# Altium project SCH-45852_C.PrjPcb (part 2 of 3)

## Sheet 07 SAI.SchDoc
size 513 x 386 mm
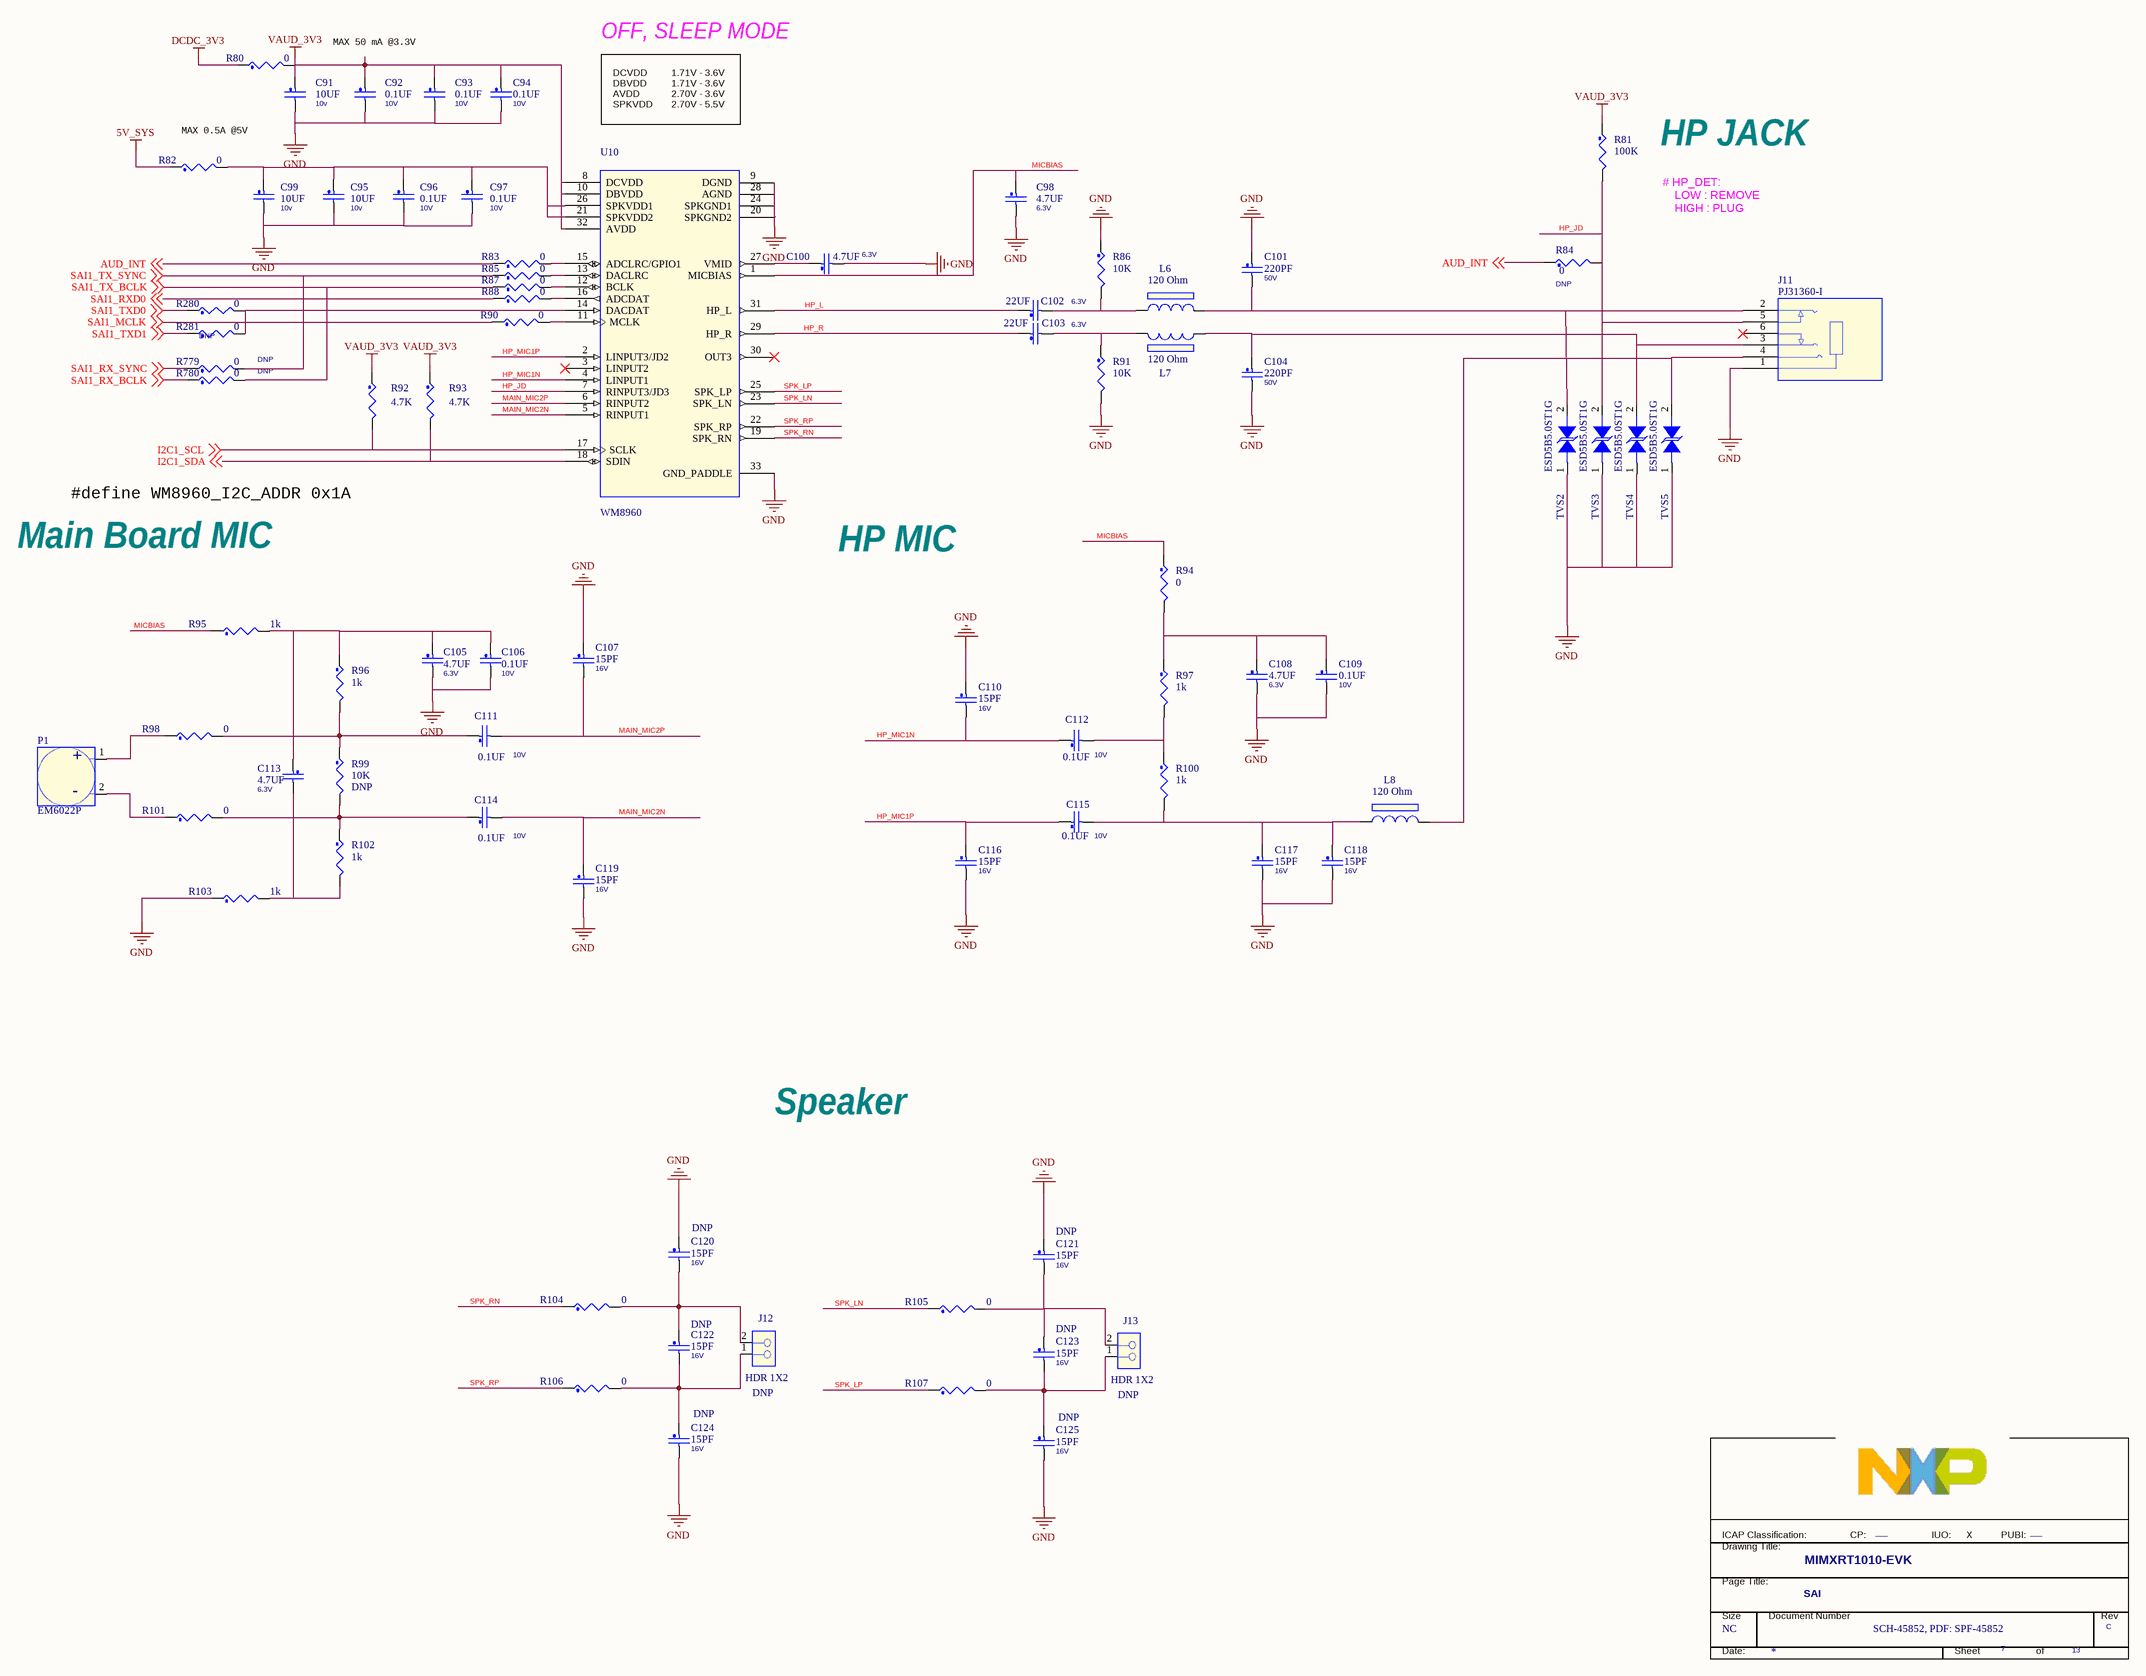
[diagram p7: 07 SAI.SchDoc]

### Parts
(Parts that share a designator on the sheet are numbered #1, #2 ... from top to bottom, then left to right.)
*#7  PUBI: ___  Doc: SCH-45852, PDF: SPF-45852  RevCode: C  Title: MIMXRT1010-EVK  Page Size: NC  Page Number: 7  Page Count: 13  PageTitle: SAI  (hidden comment: TitleBlock_FS)  (graphical)
C91  10UF  VOLTAGE: 10v  [CC0603_OV]
C92  0.1UF  VOLTAGE: 10V  [CC0402_25]
C93  0.1UF  VOLTAGE: 10V  [CC0402_25]
C94  0.1UF  VOLTAGE: 10V  [CC0402_25]
C95  10UF  VOLTAGE: 10v  [CC0603_OV]
C96  0.1UF  VOLTAGE: 10V  [CC0402_25]
C97  0.1UF  VOLTAGE: 10V  [CC0402_25]
C98  4.7UF  VOLTAGE: 6.3V  [0402_CC]
C99  10UF  VOLTAGE: 10v  [CC0603_OV]
C100  4.7UF  VOLTAGE: 6.3V  [0402_CC]
C101  220PF  VOLTAGE: 50V  [0402_CC]
C102  22UF  VOLTAGE: 6.3V  [CC0603_OV]
C103  22UF  VOLTAGE: 6.3V  [CC0603_OV]
C104  220PF  VOLTAGE: 50V  [0402_CC]
C105  4.7UF  VOLTAGE: 6.3V  [0402_CC]
C106  0.1UF  VOLTAGE: 10V  [CC0402_25]
C107  15PF  VOLTAGE: 16V  [0402_CC]
C108  4.7UF  VOLTAGE: 6.3V  [0402_CC]
C109  0.1UF  VOLTAGE: 10V  [CC0402_25]
C110  15PF  VOLTAGE: 16V  [0402_CC]
C111  0.1UF  VOLTAGE: 10V  [CC0402_25]
C112  0.1UF  VOLTAGE: 10V  [CC0402_25]
C113  4.7UF  VOLTAGE: 6.3V  [0402_CC]
C114  0.1UF  VOLTAGE: 10V  [CC0402_25]
C115  0.1UF  VOLTAGE: 10V  [CC0402_25]
C116  15PF  VOLTAGE: 16V  [0402_CC]
C117  15PF  VOLTAGE: 16V  [0402_CC]
C118  15PF  VOLTAGE: 16V  [0402_CC]
C119  15PF  VOLTAGE: 16V  [0402_CC]
C120  15PF  ASSY_OPT: DNP  VOLTAGE: 16V  [0402_CC]
C121  15PF  ASSY_OPT: DNP  VOLTAGE: 16V  [0402_CC]
C122  15PF  ASSY_OPT: DNP  VOLTAGE: 16V  [0402_CC]
C123  15PF  ASSY_OPT: DNP  VOLTAGE: 16V  [0402_CC]
C124  15PF  ASSY_OPT: DNP  VOLTAGE: 16V  [0402_CC]
C125  15PF  ASSY_OPT: DNP  VOLTAGE: 16V  [0402_CC]
J11  PJ31360-I  [con6_audjack_ra_th]
J12  HDR 1X2  ASSY_OPT: DNP  [HDR102]
J13  HDR 1X2  ASSY_OPT: DNP  [HDR102]
L6  120 Ohm  [0402_CC]
L7  120 Ohm  [0402_CC]
L8  120 Ohm  [0402_CC]
P1  EM6022P  [mic_WM-63PR]
R80  0  [0402_CC]
R81  100K  [0402_CC]
R82  0  [0402_CC]
R83  0  [0402_CC]
R84  0  ASSY_OPT: DNP  [0402_CC]
R85  0  [0402_CC]
R86  10K  [0402_CC]
R87  0  [0402_CC]
R88  0  [0402_CC]
R90  0  [0402_CC]
R91  10K  [0402_CC]
R92  4.7K  [RC0402_25]
R93  4.7K  [RC0402_25]
R94  0  [0402_CC]
R95  1k  [0402_CC]
R96  1k  [0402_CC]
R97  1k  [0402_CC]
R98  0  [0402_CC]
R99  10K  ASSY_OPT: DNP  [0402_CC]
R100  1k  [0402_CC]
R101  0  [0402_CC]
R102  1k  [0402_CC]
R103  1k  [0402_CC]
R104  0  [0402_CC]
R105  0  [0402_CC]
R106  0  [0402_CC]
R107  0  [0402_CC]
R280  0  [0402_CC]
R281  0  ASSY_OPT: DNP  [0402_CC]
R779  0  ASSY_OPT: DNP  [0402_CC]
R780  0  ASSY_OPT: DNP  [0402_CC]
TVS2  ESD5B5.0ST1G  [diode2_sod523]
TVS3  ESD5B5.0ST1G  [diode2_sod523]
TVS4  ESD5B5.0ST1G  [diode2_sod523]
TVS5  ESD5B5.0ST1G  [diode2_sod523]
U10  WM8960  [qfn32_s142ep]

### Nets
5V_SYS: R82.1
DCDC_3V3: R80.1
GND: C91.2 C92.2 C93.2 C94.2 C95.2 C96.2 C97.2 C98.2 C99.2 C100.2 C101.1 C104.2 C105.2 C106.2 C107.1 C108.2 C109.2 C110.1 C116.2 C117.2 C118.2 C119.2 C120.1 C121.1 C124.2 C125.2 J11.1 R86.1 R91.2 R103.1 TVS2.1(A1) TVS3.1(A1) TVS4.1(A1) TVS5.1(A1) U10.9(DGND) U10.20(SPKGND2) U10.24(SPKGND1) U10.28(AGND) U10.33(GND_PADDLE)
VAUD_3V3: C91.1 C92.1 C93.1 C94.1 R80.2 R81.1 R92.1 R93.1 U10.8(DCVDD) U10.10(DBVDD) U10.32(AVDD)
AUD_INT: R83.1 R84.1 ; off-sheet AUD_INT
HP_JD: J11.5 R81.2 R84.2 TVS3.2(A2) U10.7(RINPUT3/JD3)
HP_L: C102.1 U10.31(HP_L)
HP_MIC1N: C110.2 C112.1 U10.4(LINPUT1)
HP_MIC1P: C115.1 C116.1 U10.2(LINPUT3/JD2)
HP_R: C103.1 U10.29(HP_R)
I2C1_SCL: R92.2 U10.17(SCLK) ; off-sheet I2C1_SCL
I2C1_SDA: R93.2 U10.18(SDIN) ; off-sheet I2C1_SDA
MAIN_MIC2N: C114.2 C119.1 U10.5(RINPUT1)
MAIN_MIC2P: C107.2 C111.2 U10.6(RINPUT2)
MICBIAS: C98.1 R94.1 R95.1 U10.1(MICBIAS)
SAI1_MCLK: R90.1 ; off-sheet SAI1_MCLK
SAI1_RX_BCLK: R780.1 ; off-sheet SAI1_RX_BCLK
SAI1_RX_SYNC: R779.1 ; off-sheet SAI1_RX_SYNC
SAI1_RXD0: R88.1 ; off-sheet SAI1_RXD0
SAI1_TX_BCLK: R87.1 R780.2 ; off-sheet SAI1_TX_BCLK
SAI1_TX_SYNC: R85.1 R779.2 ; off-sheet SAI1_TX_SYNC
SAI1_TXD0: R280.1 ; off-sheet SAI1_TXD0
SAI1_TXD1: R281.1 ; off-sheet SAI1_TXD1
SPK_LN: R105.1 U10.23(SPK_LN)
SPK_LP: R107.1 U10.25(SPK_LP)
SPK_RN: R104.1 U10.19(SPK_RN)
SPK_RP: R106.1 U10.22(SPK_RP)
NetC95_1: C95.1 C96.1 C97.1 C99.1 R82.2 U10.21(SPKVDD2) U10.26(SPKVDD1)
NetC100_1: C100.1 U10.27(VMID)
NetC101_2: C101.2 J11.2 L6.2 TVS2.2(A2)
NetC102_2: C102.2 L6.1 R86.2
NetC103_2: C103.2 L7.1 R91.1
NetC104_1: C104.1 J11.3 L7.2 TVS4.2(A2)
NetC105_1: C105.1 C106.1 C113.1 R95.2 R96.1
NetC108_1: C108.1 C109.1 R94.2 R97.1
NetC111_1: C111.1 R96.2 R98.2 R99.1
NetC112_2: C112.2 R97.2 R100.1
NetC113_2: C113.2 R102.2 R103.2
NetC114_1: C114.1 R99.2 R101.2 R102.1
NetC115_2: C115.2 C117.1 C118.1 L8.1 R100.2
NetC120_2: C120.2 C122.1 J12.2 R104.2
NetC121_2: C121.2 C123.1 J13.2 R105.2
NetC122_2: C122.2 C124.1 J12.1 R106.2
NetC123_2: C123.2 C125.1 J13.1 R107.2
NetJ11_4: J11.4 L8.2 TVS5.2(A2)
NetP1_1: P1.1(Out) R98.1
NetP1_2: P1.2(GND) R101.1
NetR83_2: R83.2 U10.15(ADCLRC/GPIO1)
NetR85_2: R85.2 U10.13(DACLRC)
NetR87_2: R87.2 U10.12(BCLK)
NetR88_2: R88.2 U10.16(ADCDAT)
NetR90_2: R90.2 U10.11(MCLK)
NetR280_2: R280.2 R281.2 U10.14(DACDAT)

Not connected (* = marked no-connect by the designer): J11 6*; U10 3(LINPUT2)* 30(OUT3)*

### Notes on the sheet
- MAX 50 mA @3.3V
- OFF, SLEEP MODE
- DCVDD
  DBVDD
  AVDD
  SPKVDD
- 1.71V - 3.6V
  1.71V - 3.6V
  2.70V - 3.6V
  2.70V - 5.5V
- (near R82) MAX 0.5A @5V
- HP JACK
- # HP_DET:
  LOW : REMOVE
  HIGH : PLUG
- #define WM8960_I2C_ADDR 0x1A
- Main Board MIC
- HP MIC
- Speaker
- X
- (in symbol MIC_POM) +; -
- (in symbol TitleBlock_FS) ICAP Classification:; CP:; IUO:; PUBI:; Drawing Title:; Page Title:; Size; Document Number; Rev; Date:; Sheet; of

### Library data of the parts
*#7 = TitleBlock_FS: as *#5 on sheet 05 MIMXRT1010 PART2; FCP: ___; Page Create Date: March  8, 1995; Page Modify Date: *
C91 = CAP_NP: CAP CER 10UF 10V 10% X5R 0603; CLASS: DISCRETE; FPLIST: CC0603_OV,CC0603,0603_CC; CAD_APPROVED: Yes; Temp_Range: -55¡ãC ~ 85¡ãC; MFG_PN01: GRM188R61A106KE69D; MFG_NAME01: MURATA; AGILE_PN: 150-78675; HEIGHT: 1.016MM; ROHS: Yes; Tolerance: 10%; PCB Footprint: CC0603_OV
C92 C93 C96 C97 C109 C112 C114 = CAP_NP: CAP CER 0.1UF 10V 10% X5R 0402; CLASS: DISCRETE; AGILE_PN: 150-75634; MFG_NAME01: YAGEO AMERICA; MFG_PN01: CC0402KRX5R6BB104; CAD_APPROVED: Yes; FPLIST: CC0402_25,CC0402_HD,0402_CC; Tolerance: 10%; ROHS: Yes; HEIGHT: 0.64MM; PCB Footprint: CC0402_25
C94 C106 C111 C115 = CAP_NP: as C41 on sheet 03 MAIN POWER; HEIGHT: 0.64MM; ROHS: Yes; Tolerance: 10%; PCB Footprint: CC0402_25
C95 C99 = CAP_NP: CAP CER 10UF 10V 10% X5R 0603; CLASS: DISCRETE; AGILE_PN: 150-78675; MFG_NAME01: MURATA; MFG_PN01: GRM188R61A106KE69D; Temp_Range: -55¡ãC ~ 85¡ãC; CAD_APPROVED: Yes; FPLIST: CC0603_OV,CC0603,0603_CC; Tolerance: 10%; ROHS: Yes; HEIGHT: 1.016MM; PCB Footprint: CC0603_OV
C98 C100 C105 C113 = CAP_NP: CAP CER 4.7UF 6.3V 20% X5R 0402; CLASS: DISCRETE; FPLIST: CC0402_25,CC0402_HD,0402_CC; CAD_APPROVED: Yes; MFG_PN01: C1005X5R0J475M050BC; MFG_NAME01: TDK; AGILE_PN: 150-78463; HEIGHT: 0.65MM; ROHS: Yes; Tolerance: 20%; voltage rating: 6.3V; PCB Footprint: 0402_CC
C101 C104 = CAP_NP: CAP CER 220PF 50V 5% C0G 0402; CLASS: DISCRETE; FPLIST: CC0402_25,CC0402_HD,0402_CC; CAD_APPROVED: Yes; MFG_PN01: C0402C221J5GAC; MFG_NAME01: KEMET; AGILE_PN: 150-30297; HEIGHT: 0.55MM; ROHS: Yes; Tolerance: 5%; PCB Footprint: 0402_CC
C102 C103 = CAP_NP: CAP CER 22UF 6.3V 20% X5R 0603; CLASS: DISCRETE; FPLIST: CC0603_OV,CC0603,0603_CC; CAD_APPROVED: Yes; MFG_PN01: CL10A226MQ8NRNE; MFG_NAME01: Samsung; AGILE_PN: 150-78467; HEIGHT: 1MM; ROHS: Yes; Tolerance: 20%; PCB Footprint: CC0603_OV
C107 C117-C119 C124 C125 = CAP_NP: CAP CER 15PF 16V 5% C0G 0402; CLASS: DISCRETE; AGILE_PN: 150-75720; MFG_NAME01: KEMET; MFG_PN01: C0402C150J4GAC; CAD_APPROVED: Yes; FPLIST: CC0402_25,CC0402_HD,0402_CC; Tolerance: 5%; ROHS: Yes; HEIGHT: 0.55MM; PCB Footprint: 0402_CC
C108 = CAP_NP: CAP CER 4.7UF 6.3V 20% X5R 0402; CLASS: DISCRETE; AGILE_PN: 150-78463; MFG_NAME01: TDK; MFG_PN01: C1005X5R0J475M050BC; CAD_APPROVED: Yes; FPLIST: CC0402_25,CC0402_HD,0402_CC; voltage rating: 6.3V; Tolerance: 20%; ROHS: Yes; HEIGHT: 0.65MM; PCB Footprint: 0402_CC
C110 C116 C120-C123 = CAP_NP: CAP CER 15PF 16V 5% C0G 0402; CLASS: DISCRETE; FPLIST: CC0402_25,CC0402_HD,0402_CC; CAD_APPROVED: Yes; MFG_PN01: C0402C150J4GAC; MFG_NAME01: KEMET; AGILE_PN: 150-75720; HEIGHT: 0.55MM; ROHS: Yes; Tolerance: 5%; PCB Footprint: 0402_CC
J11 = CONN_AUDIOJACK_6P: CON 6 AUD JACK RA SMT -- 191H AU; CLASS: IO; CAD_APPROVED: Yes; MFG_NAME01: SHENZHEN ATOM TECHNOLOGY CO.,LTD; AGILE_PN: 211-79704; PCB Footprint: con6_audjack_ra_th; HEIGHT: 4.85 MM; ROHS: Yes; MFG_PN01: PJ31360-I
J12 J13 = CONN_HDR_2X1: HDR 1X2 TH 100MIL SP 339H AU 98L; CLASS: IO; CAD_APPROVED: Yes; Temp_Range: -55¡ãC to +105¡ãC; MFG_PN01: 0901S0202011N9T-31RF; MFG_NAME01: ANYTRONIC CORPORATION LIMITED; AGILE_PN: 210-81490; PCB Footprint: HDR102; HEIGHT: 8.59MM; ROHS: Yes
L6 L8 = INDUCTOR_FERRITE: IND FER BEAD 120 OHM@100MHZ 0.5A 25% 0402; PART_TYPE: FERRITE\BEAD; CLASS: DISCRETE; AGILE_PN: 180-77771; MFG_NAME01: Murata; MFG_PN01: BLM15AG121SN1D; CAD_APPROVED: Yes; FPLIST: IND_0402,0402_CC; Tolerance: 25%; ROHS: Yes; HEIGHT: 0.55MM; PCB Footprint: 0402_CC
L7 = INDUCTOR_FERRITE: IND FER BEAD 120 OHM@100MHZ 0.5A 25% 0402; PART_TYPE: FERRITE\BEAD; CLASS: DISCRETE; FPLIST: IND_0402,0402_CC; CAD_APPROVED: Yes; MFG_PN01: BLM15AG121SN1D; MFG_NAME01: Murata; AGILE_PN: 180-77771; HEIGHT: 0.55MM; ROHS: Yes; Tolerance: 25%; PCB Footprint: 0402_CC
P1 = MIC_POM: AUDIO DEVICE MIC 0.5MA 2V 38-48+/-3dB 2.2KOHM 6MM TH; CLASS: IC; AGILE_PN: 510-77987; MFG_NAME01: Soberton Inc; CAD_APPROVED: Yes; PCB Footprint: mic_WM-63PR; MFG_PN01: EM6022P; ROHS: Yes; HEIGHT: 2.4MM
R80 R83 R85 R88 R90 R104 R107 R779 = RES_Dup1: as R37 on sheet 03 MAIN POWER; PCB Footprint: 0402_CC; HEIGHT: 0.45 MM; Tolerance: 5%; ROHS: Yes
R81 = RES_Dup1: RES MF 100K 1/16W 5% 0402; CLASS: DISCRETE; Temp_Range: -55C to +155C; FPLIST: RC0402_25,RC0402_HD,0402_CC; CAD_APPROVED: Yes; MFG_PN01: CR0402-16W-104JT; MFG_NAME01: VENKEL COMPANY; AGILE_PN: 470-75597; PCB Footprint: 0402_CC; HEIGHT: 0.40 MM; ROHS: Yes; Tolerance: 5%
R82 R84 R87 R94 R98 R101 R105 R106 R280 R281 R780 = RES_Dup1: as R35 on sheet 03 MAIN POWER; PCB Footprint: 0402_CC; ROHS: Yes; Tolerance: 5%; HEIGHT: 0.45 MM
R86 = RES_Dup1: RES MF 10K 1/16W 5% 0402; CLASS: DISCRETE; FPLIST: RC0402_25,RC0402_HD,0402_CC; CAD_APPROVED: Yes; MFG_PN01: CRCW040210K0JNED; MFG_NAME01: VISHAY INTERTECHNOLOGY; AGILE_PN: 470-75557; PCB Footprint: 0402_CC; HEIGHT: 0.4 MM; ROHS: Yes; Tolerance: 5%
R91 R99 = RES_Dup1: as R41 on sheet 03 MAIN POWER; PCB Footprint: 0402_CC; HEIGHT: 0.4 MM; Tolerance: 5%; ROHS: Yes
  R99: TOL: 5%
R92 = RES_Dup1: RES MF 4.7K 1/16W 5% 0402; CLASS: DISCRETE; FPLIST: RC0402_25,RC0402_HD,0402_CC; CAD_APPROVED: Yes; MFG_PN01: NRCL04J472TRF; MFG_NAME01: NIC COMPONENTS CORP; AGILE_PN: 470-75626; PCB Footprint: RC0402_25; HEIGHT: 0.41mm; ROHS: Yes; Tolerance: 5%
R93 = RES_Dup1: RES MF 4.7K 1/16W 5% 0402; CLASS: DISCRETE; AGILE_PN: 470-75626; MFG_NAME01: NIC COMPONENTS CORP; MFG_PN01: NRCL04J472TRF; CAD_APPROVED: Yes; FPLIST: RC0402_25,RC0402_HD,0402_CC; PCB Footprint: RC0402_25; Tolerance: 5%; ROHS: Yes; HEIGHT: 0.41mm
R95 R97 R100 R103 = RES_Dup1: RES MF 1.0K 1/16W 5% 0402; CLASS: DISCRETE; FPLIST: RC0402_25,RC0402_HD,RC0402_X2,0402_CC; CAD_APPROVED: Yes; MFG_PN01: CRCW04021K00JNED; MFG_NAME01: VISHAY INTERTECHNOLOGY; AGILE_PN: 470-75555; PCB Footprint: 0402_CC; HEIGHT: 0.41mm; ROHS: Yes; Tolerance: 5%
R96 R102 = RES_Dup1: RES MF 1.0K 1/16W 5% 0402; CLASS: DISCRETE; AGILE_PN: 470-75555; MFG_NAME01: VISHAY INTERTECHNOLOGY; MFG_PN01: CRCW04021K00JNED; CAD_APPROVED: Yes; FPLIST: RC0402_25,RC0402_HD,RC0402_X2,0402_CC; PCB Footprint: 0402_CC; HEIGHT: 0.41mm; Tolerance: 5%; ROHS: Yes
TVS2-TVS5 = DIODE_TVS_BIDIR: DIODE SUPPRESSOR 16A@30NS 5V@1UA SOD-523; CLASS: IC; AGILE_PN: 480-76937; MFG_NAME01: on semiconductor; CAD_APPROVED: Yes; PCB Footprint: diode2_sod523; MFG_PN01: ESD5B5.0ST1G; ROHS: Yes; HEIGHT: 0.7MM
U10 = WM8960_QFN_33P: IC CODEC STEREO WITH CLASS D SPEAKER DRIVER 1.71-3.6V QFN32; CAD_APPROVED: Yes; MFG_PN01: WM8960CGEFL/RV; MFG_NAME01: WOLFSON MICROELECTRONICS; AGILE_PN: 315-79450; CLASS: IC; PCB Footprint: qfn32_s142ep; HEIGHT: 1MM; ROHS: Yes

## Sheet 08 SPDIF.SchDoc
size 513 x 386 mm
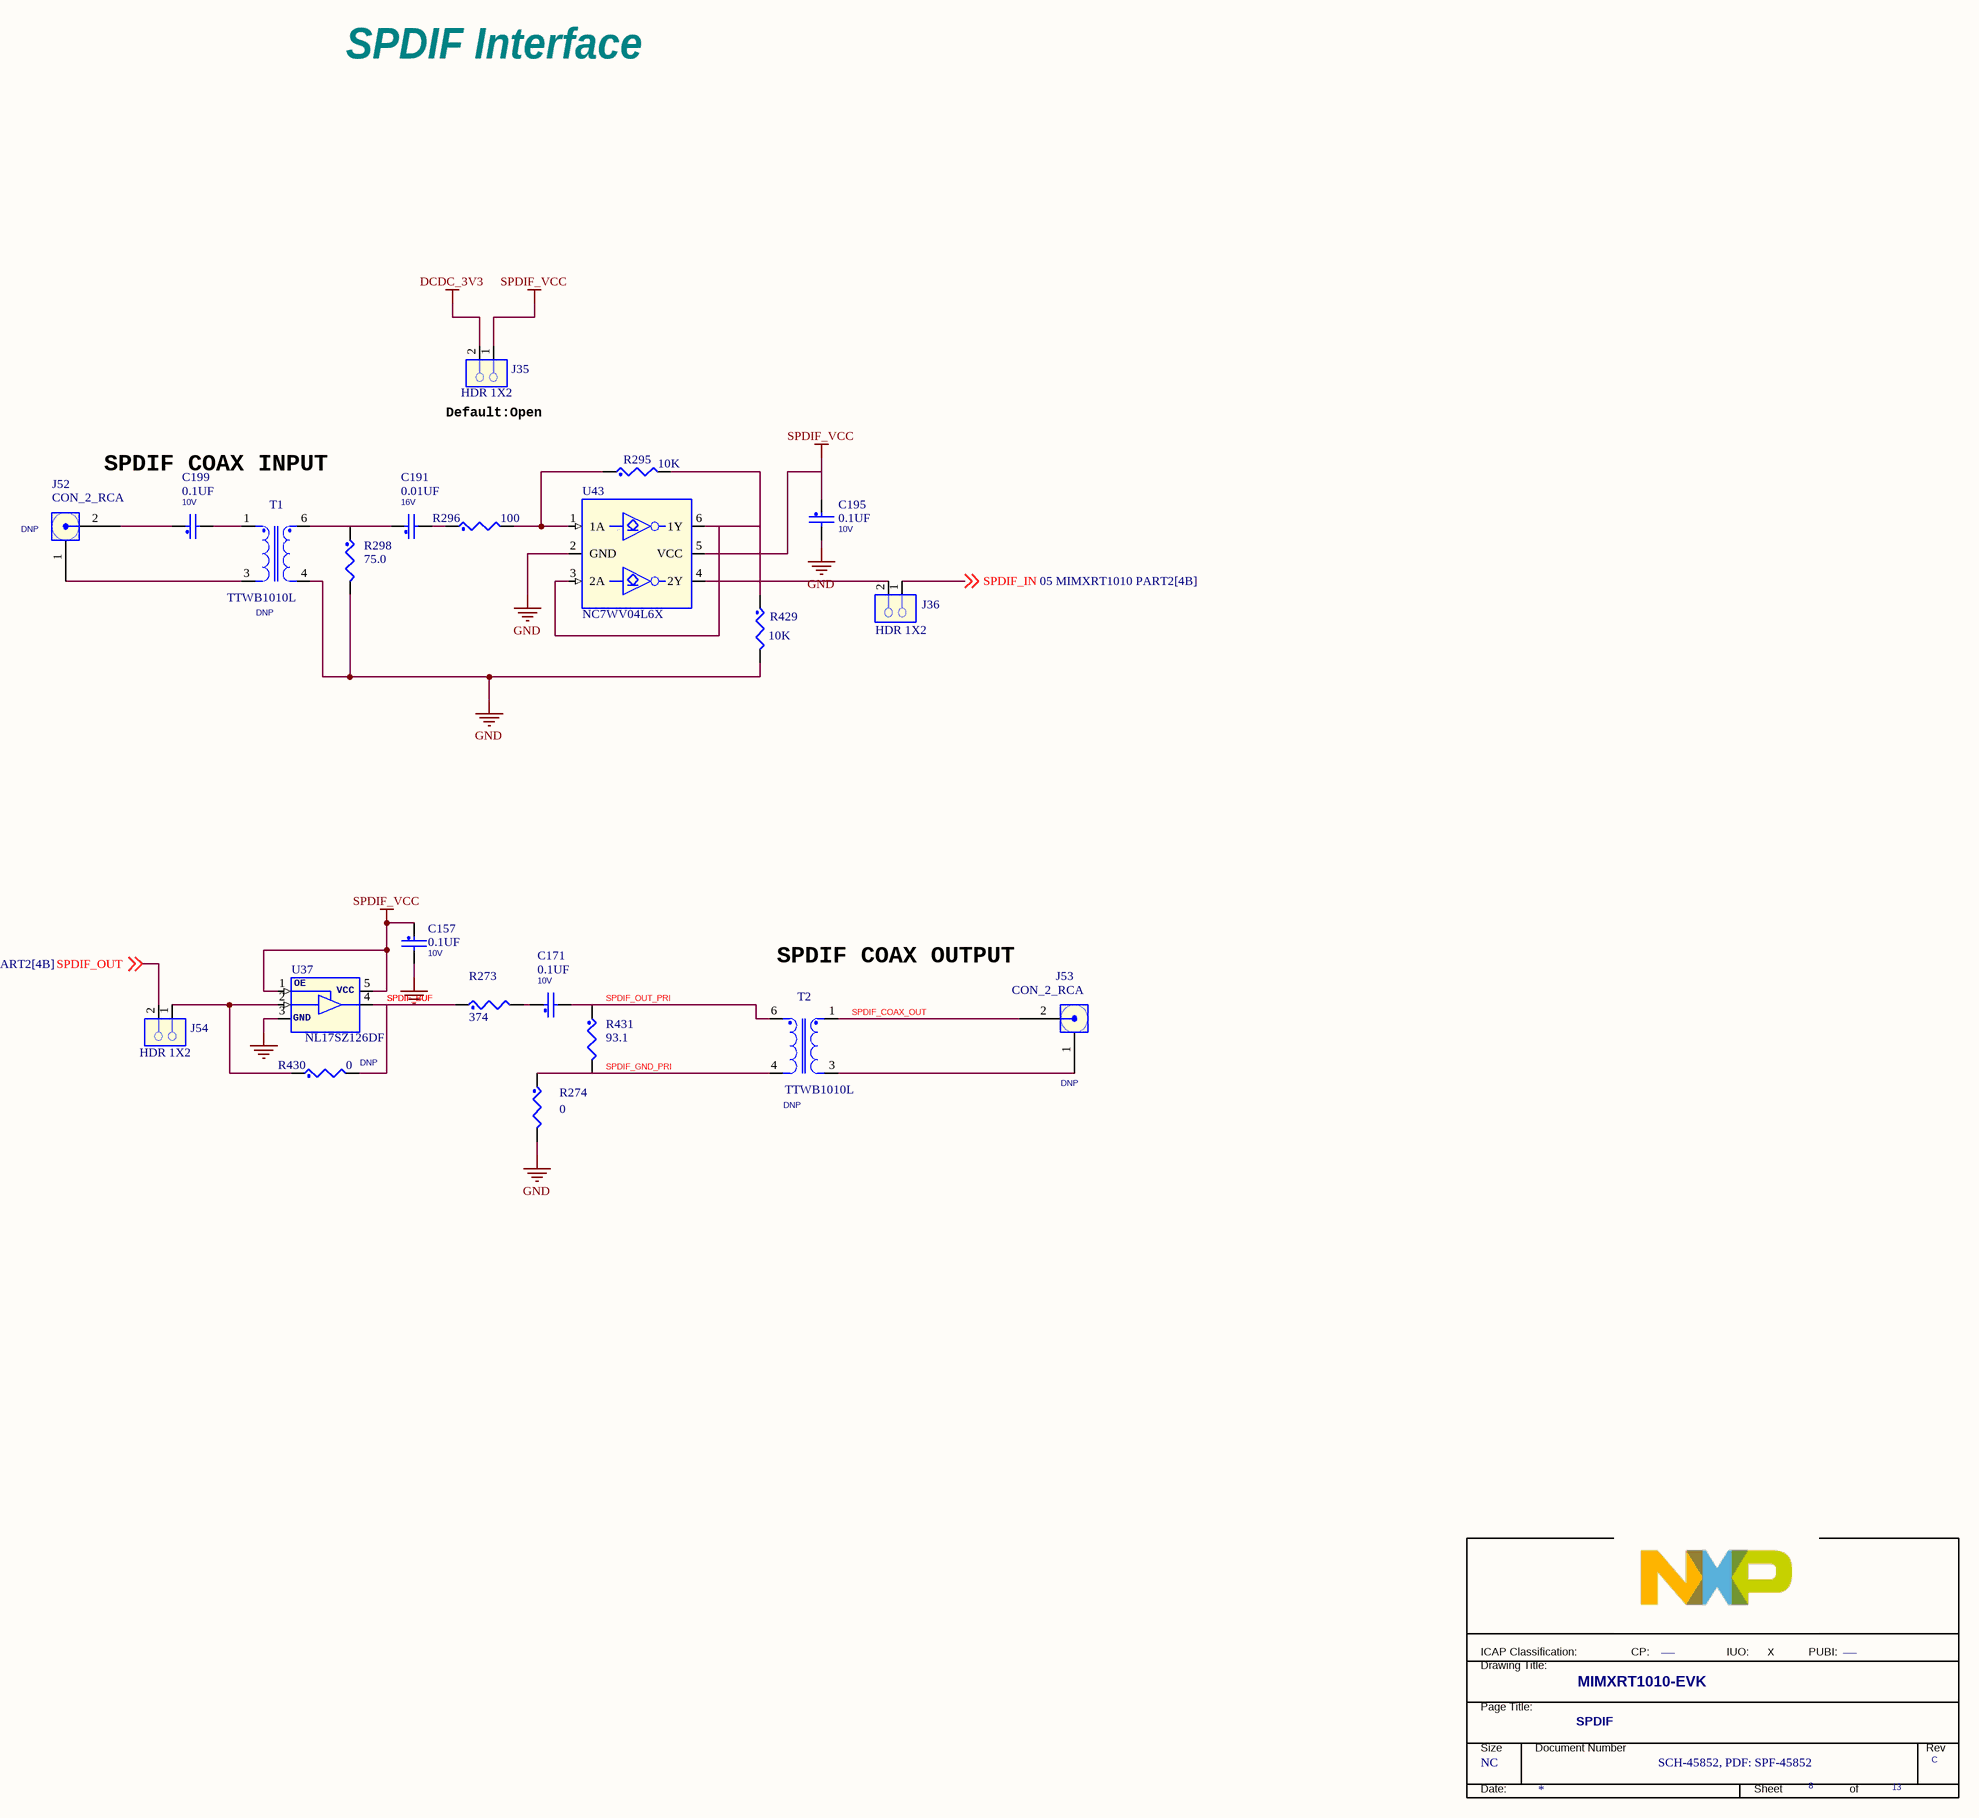
[diagram p8: 08 SPDIF.SchDoc]

### Parts
(Parts that share a designator on the sheet are numbered #1, #2 ... from top to bottom, then left to right.)
*#8  PUBI: ___  Doc: SCH-45852, PDF: SPF-45852  RevCode: C  Title: MIMXRT1010-EVK  Page Size: NC  Page Number: 8  Page Count: 13  PageTitle: SPDIF  (hidden comment: TitleBlock_FS)  (graphical)
C157  0.1UF  VOLTAGE: 10V  [0402_CC]
C171  0.1UF  VOLTAGE: 10V  [0402_CC]
C191  0.01UF  VOLTAGE: 16V  [0402_CC]
C195  0.1UF  VOLTAGE: 10V  [0402_CC]
C199  0.1UF  VOLTAGE: 10V  [0402_CC]
J35  HDR 1X2  [HDR102]
J36  HDR 1X2  [HDR102]
J52  CON_2_RCA  ASSY_OPT: DNP  [con2_rca_ra_th]
J53  CON_2_RCA  ASSY_OPT: DNP  [con2_rca_ra_th]
J54  HDR 1X2  [HDR102]
R273  374  [RC0805_OV]
R274  0  [0402_CC]
R295  10K  [0402_CC]
R296  100  [0402_CC]
R298  75.0  [RC0805_OV]
R429  10K  [0402_CC]
R430  0  ASSY_OPT: DNP  [0402_CC]
R431  93.1  [RC0603_OV]
T1  TTWB1010L  ASSY_OPT: DNP  [xfmr6_6p6x6p2]
T2  TTWB1010L  ASSY_OPT: DNP  [xfmr6_6p6x6p2]
U37  NL17SZ126DF  [SC-70]
U43  NC7WV04L6X  [SOT363]

### Nets
DCDC_3V3: J35.2
GND: C157.2 C195.2 R274.2 R298.2 R429.2 T1.4 U37.3(GND) U43.2(GND)
SPDIF_VCC: C157.1 C195.1 J35.1 U37.1(OE) U37.5(VCC) U43.5(VCC)
SPDIF_BUF: R273.1 R430.2 U37.4(Y)
SPDIF_COAX_OUT: J53.2 T2.1
SPDIF_GND_PRI: R274.1 R431.2 T2.4
SPDIF_IN: J36.1 ; off-sheet SPDIF_IN  [project net LPUART1_TXD]
SPDIF_OUT: J54.2 ; off-sheet SPDIF_OUT  [project net GPIO_11]
SPDIF_OUT_PRI: C171.2 R431.1 T2.6
NetC171_1: C171.1 R273.2
NetC191_1: C191.1 R298.1 T1.6
NetC191_2: C191.2 R296.1
NetC199_1: C199.1 J52.2
NetC199_2: C199.2 T1.1
NetJ36_2: J36.2 U43.4(2Y)
NetJ52_1: J52.1 T1.3
NetJ53_1: J53.1 T2.3
NetJ54_1: J54.1 R430.1 U37.2(A)
NetR295_1: R295.1 R296.2 U43.1(1A)
NetR295_2: R295.2 R429.1 U43.3(2A) U43.6(1Y)

### Notes on the sheet
- SPDIF Interface
- SPDIF COAX INPUT
- (near J35) Default:Open
- (near T2) SPDIF COAX OUTPUT
- X
- (in symbol TitleBlock_FS) ICAP Classification:; CP:; IUO:; PUBI:; Drawing Title:; Page Title:; Size; Document Number; Rev; Date:; Sheet; of

### Library data of the parts
*#8 = TitleBlock_FS: as *#2 on sheet 02 BLOCK DIAGRAM; FCP: ___; Page Create Date: March  8, 1995; Page Modify Date: *
C157 C171 = CAP_NP: as C92 on sheet 07 SAI; Tolerance: 10%; ROHS: Yes; HEIGHT: 0.64MM; PCB Footprint: 0402_CC
C191 = CAP_NP: CAP CER 0.01UF 16V 20% X7R 0402; CLASS: DISCRETE; AGILE_PN: 150-30082; MFG_NAME01: AVX; MFG_PN01: 0402YC103MAT2A; CAD_APPROVED: Yes; FPLIST: CC0402_25,CC0402_HD,0402_CC; Tolerance: 20%; ROHS: Yes; HEIGHT: 0.56MM; TOL: 20%; PCB Footprint: 0402_CC
C195 C199 = CAP_NP: as C41 on sheet 03 MAIN POWER; HEIGHT: 0.64MM; ROHS: Yes; Tolerance: 10%; PCB Footprint: 0402_CC
J35 J54 = CONN_HDR_2X1: as J8 on sheet 03 MAIN POWER; PCB Footprint: HDR102; ROHS: Yes; HEIGHT: 8.59MM
J36 = CONN_HDR_2X1: as J12 on sheet 07 SAI; PCB Footprint: HDR102; HEIGHT: 8.59MM; ROHS: Yes
J52 J53 = KLPX0848A: CON 2 RCA SKT RA TH BLACK -- 512H SN; AGILE_PN: 210-78092; MFG_NAME01: KYCON; MFG_PN01: KLPX-0848A-2-B; CAD_APPROVED: Yes; PRIORITY_PN: 009-00703; PCB Footprint: con2_rca_ra_th; ROHS: Yes; HEIGHT: 13MM
R273 = RES_Dup1: RES MF 374 OHM 1/8W 1% 0805; CLASS: DISCRETE; AGILE_PN: 470-80029; MFG_NAME01: VISHAY INTERTECHNOLOGY; MFG_PN01: CRCW0805374RFKEA; CAD_APPROVED: Yes; FPLIST: RC0805_OV,RC0805,0805_CC; Tolerance: 1%; ROHS: Yes; HEIGHT: 0.5MM; TOL: 1%; PCB Footprint: RC0805_OV
R274 R430 = RES_Dup1: as R35 on sheet 03 MAIN POWER; ROHS: Yes; Tolerance: 5%; HEIGHT: 0.45 MM; PCB Footprint: 0402_CC
R295 R429 = RES_Dup1: as R86 on sheet 07 SAI; PCB Footprint: 0402_CC; ROHS: Yes; Tolerance: 5%; TOL: 5%; HEIGHT: 0.4 MM
R296 = RES_Dup1: RES MF 100 OHM 1/16W 1% 0402; CLASS: DISCRETE; FPLIST: RC0402_25,RC0402_HD,0402_CC; CAD_APPROVED: Yes; MFG_PN01: CR-02FL6--100R; MFG_NAME01: THYE MING TECH CO LTD; AGILE_PN: 470-30454; PCB Footprint: 0402_CC; ROHS: Yes; Tolerance: 1%; HEIGHT: 0.4 MM
R298 = RES_Dup1: RES TF 75.0 OHM 1/8W 1% 0805; CLASS: DISCRETE; AGILE_PN: 470-76238; MFG_NAME01: YAGEO AMERICA; MFG_PN01: RC0805FR-0775RL; CAD_APPROVED: Yes; FPLIST: RC0805_OV,RC0805,0805_CC; PCB Footprint: RC0805_OV; TOL: 1%; Tolerance: 1%; ROHS: Yes; HEIGHT: 0.6 MM
R431 = RES_Dup1: RES MF 93.1 OHM 1/8W 1% AEC-Q200 0603; CLASS: DISCRETE; FPLIST: RC0603_OV,RC0603,0603_CC; CAD_APPROVED: Yes; MFG_PN01: RK73H1JTTD93R1F; MFG_NAME01: KOA SPEER; AGILE_PN: 470-77900; Temp_Range: -55C to +155C; ROHS: Yes; Tolerance: 1%; HEIGHT: 0.55MM; TOL: 1%; PCB Footprint: RC0603_OV
T1 = XFMR: XFMR SMT 780UH/780UH/250MA WIDEBAND XFMR6_6.6X6.2; PART_TYPE: TRANSFORMERS; ROOM: SPDIF; AGILE_PN: 560-75273; MFG_NAME01: COILCRAFT; MFG_PN01: TTWB1010LD; CAD_APPROVED: Yes; PRIORITY_PN: 051-TTWB1010LD; PCB Footprint: xfmr6_6p6x6p2; ROHS: Yes; HEIGHT: 4.82MM
T2 = XFMR: XFMR SMT 780UH/780UH/250MA WIDEBAND XFMR6_6.6X6.2; PART_TYPE: TRANSFORMERS; PRIORITY_PN: 051-TTWB1010LD; CAD_APPROVED: Yes; MFG_PN01: TTWB1010LD; MFG_NAME01: COILCRAFT; AGILE_PN: 560-75273; ROOM: SPDIF; PCB Footprint: xfmr6_6p6x6p2; HEIGHT: 4.82MM; ROHS: Yes
U37 = 100201_SO-1: IC BUF TS 1.65-5.5V SOT-353; PRIORITY_PN: 051-NL17SZ126DF; CAD_APPROVED: YES; MFG_PN01: NL17SZ126DFT2G; MFG_NAME01: ON SEMICONDUCTOR; AGILE_PN: 312-30127; HEIGHT: 1.1 MM; ROHS: Yes; PCB Footprint: SC-70
U43 = 74AUP2G06GW: IC INVERTER ULP-A DUAL 0.93.6V MICROPAK6; PCB Footprint: MICROPAK_6P; AGILE_PN: 315-81072; MFG_NAME01: FAIRCHILD; CAD_APPROVED: Yes; CLASS: IC; MFG_PN01: NC7WV04L6X; ROHS: Yes; HEIGHT: 0.55MM

## Sheet 09 FLEXSPI FLASH.SchDoc
size 513 x 386 mm
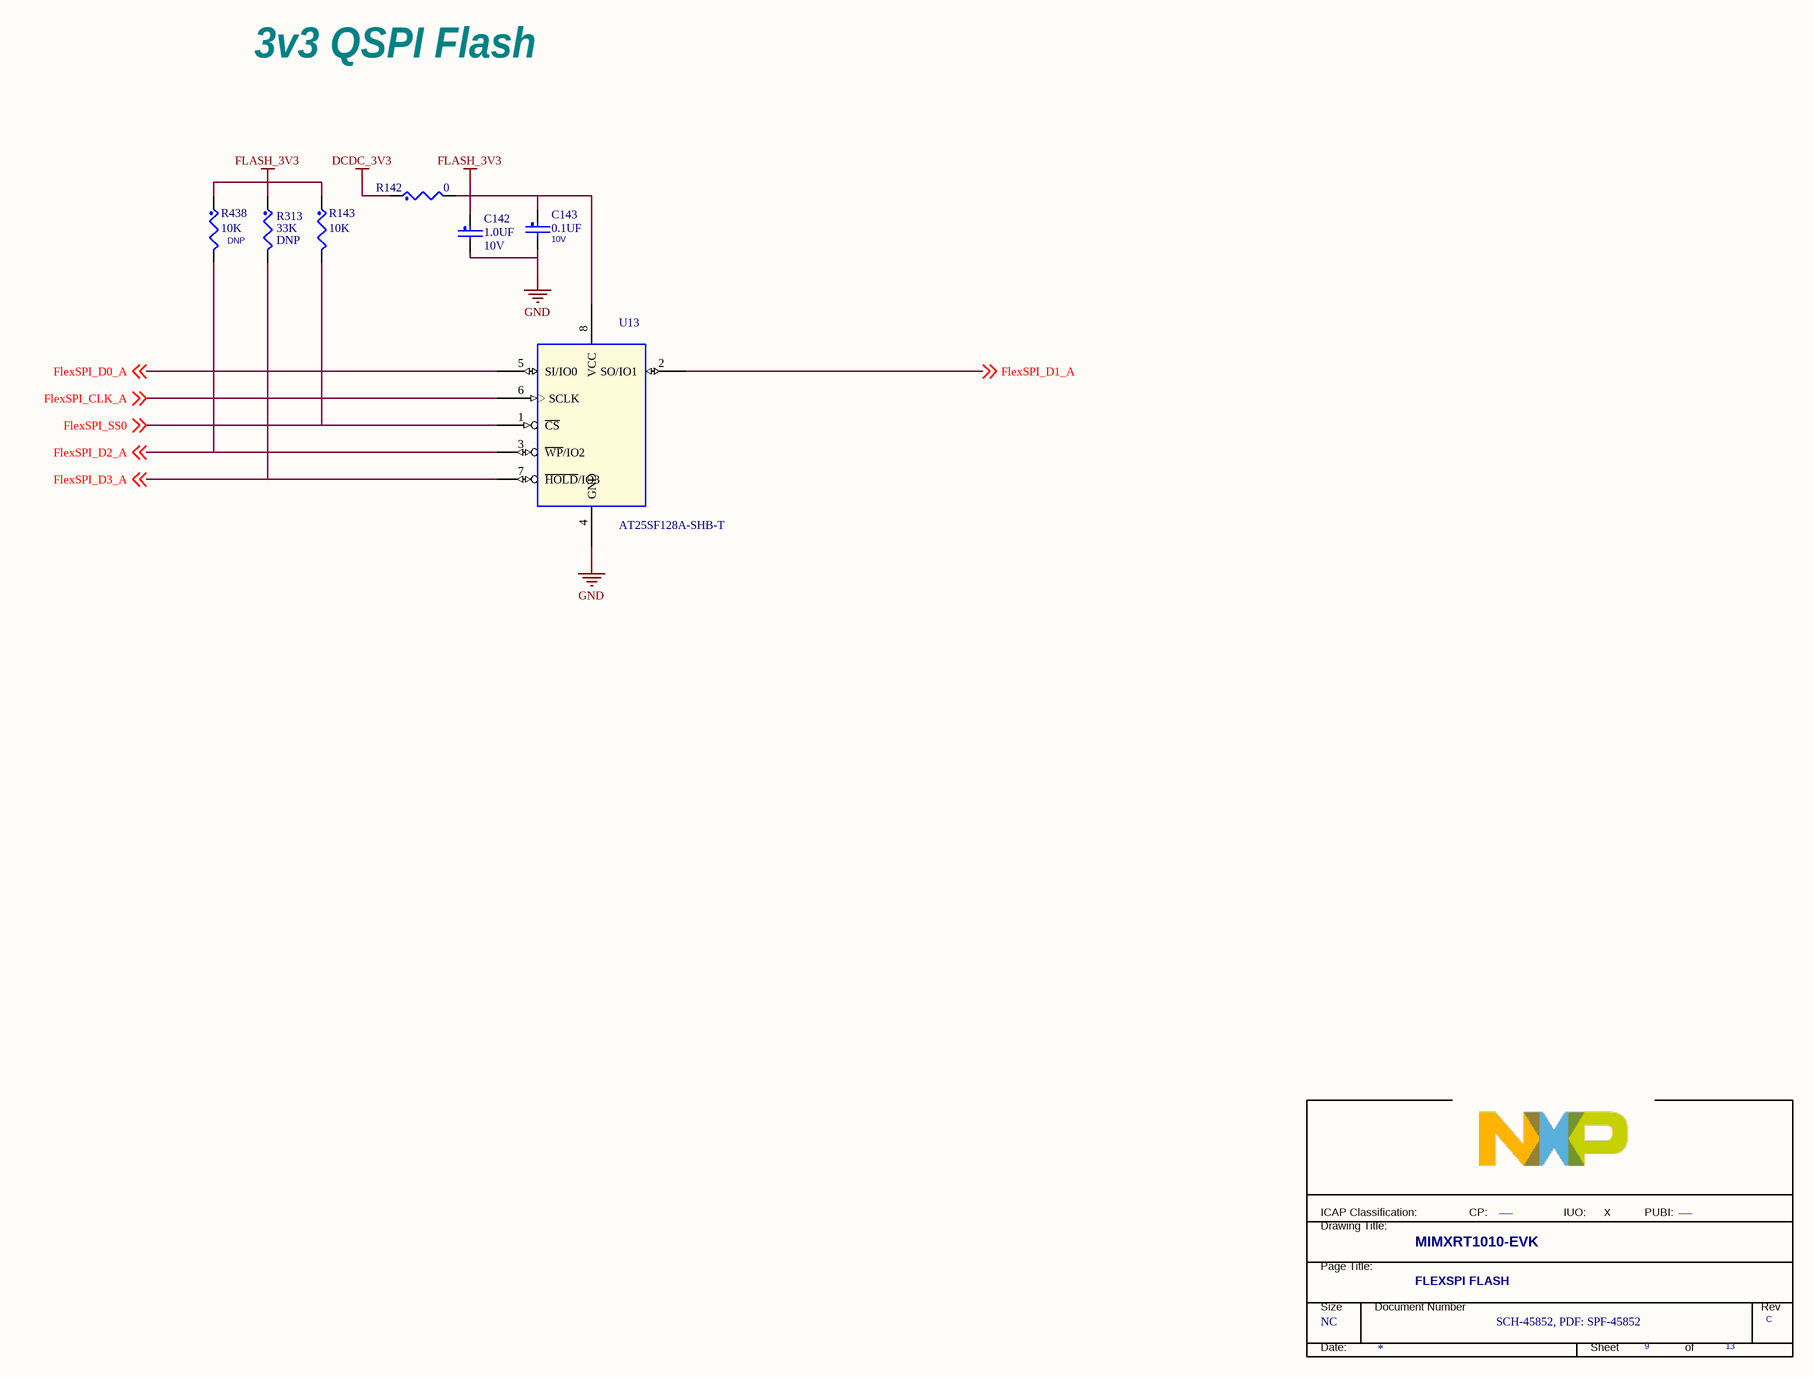
[diagram p9: 09 FLEXSPI FLASH.SchDoc]

### Parts
(Parts that share a designator on the sheet are numbered #1, #2 ... from top to bottom, then left to right.)
*#9  PUBI: ___  Doc: SCH-45852, PDF: SPF-45852  RevCode: C  Title: MIMXRT1010-EVK  Page Size: NC  Page Number: 9  Page Count: 13  PageTitle: FLEXSPI FLASH  (hidden comment: TitleBlock_FS)  (graphical)
C142  1.0UF  voltage rating: 10V  [0402_CC]
C143  0.1UF  VOLTAGE: 10V  [CC0402_25]
R142  0  [0402_CC]
R143  10K  [0402_CC]
R313  33K  ASSY_OPT: DNP  [RC0402_25]
R438  10K  ASSY_OPT: DNP  [0402_CC]
U13  AT25SF128A-SHB-T  [SO8-25X75-200]

### Nets
DCDC_3V3: R142.1
FLASH_3V3: C142.1 C143.1 R142.2 R143.1 R313.1 R438.1 U13.8(VCC)
GND: C142.2 C143.2 U13.4(GND)
FlexSPI_CLK_A: U13.6(SCLK) ; off-sheet FlexSPI_CLK_A
FlexSPI_D0_A: U13.5(SI/IO0) ; off-sheet FlexSPI_D0_A
FlexSPI_D1_A: U13.2(SO/IO1) ; off-sheet FlexSPI_D1_A
FlexSPI_D2_A: R438.2 U13.3(~{WP}/IO2) ; off-sheet FlexSPI_D2_A
FlexSPI_D3_A: R313.2 U13.7(~{HOLD}/IO3) ; off-sheet FlexSPI_D3_A
FlexSPI_SS0: R143.2 U13.1(~{CS}) ; off-sheet FlexSPI_SS0

### Notes on the sheet
- 3v3 QSPI Flash
- X
- (in symbol TitleBlock_FS) ICAP Classification:; CP:; IUO:; PUBI:; Drawing Title:; Page Title:; Size; Document Number; Rev; Date:; Sheet; of

### Library data of the parts
*#9 = TitleBlock_FS: FIUO: _X_; OrgName: Freescale Semiconductor; OrgAddr1: 6501 William Cannon Drive West; OrgAddr2: Austin, TX 78735-8598; FCP: ___; Page Create Date: March  8, 1995; Page Modify Date: *
C142 = CAP_NP: CAP CER 1.0UF 10V 10% X5R 0402; CLASS: DISCRETE; FPLIST: CC0402_25,CC0402_HD,0402_CC; CAD_APPROVED: Yes; MFG_PN01: CC0402KRX5R6BB105; MFG_NAME01: YAGEO AMERICA; AGILE_PN: 150-75772; PCB Footprint: 0402_CC; VOLTAGE: 10V; HEIGHT: 0.6MM; ROHS: Yes
C143 = CAP_NP: CAP CER 0.1UF 10V 10% X5R 0402; CLASS: DISCRETE; FPLIST: CC0402_25,CC0402_HD,0402_CC; CAD_APPROVED: Yes; MFG_PN01: CC0402KRX5R6BB104; MFG_NAME01: YAGEO AMERICA; AGILE_PN: 150-75634; PCB Footprint: CC0402_25; HEIGHT: 0.64MM; ROHS: Yes; Tolerance: 10%
R142 = RES_Dup1: RES MF ZERO OHM 1/16W 5% 0402; CLASS: DISCRETE; FPLIST: RC0402_25,RC0402_HD,RC0402_X2,0402_CC; CAD_APPROVED: Yes; MFG_PN01: MCR01MZPJ000; MFG_NAME01: ROHM; AGILE_PN: 470-75394; ROHS: Yes; Tolerance: 5%; HEIGHT: 0.45 MM; PCB Footprint: 0402_CC
R143 R438 = RES_Dup1: RES MF 10K 1/16W 5% 0402; CLASS: DISCRETE; AGILE_PN: 470-75557; MFG_NAME01: VISHAY INTERTECHNOLOGY; MFG_PN01: CRCW040210K0JNED; CAD_APPROVED: Yes; FPLIST: RC0402_25,RC0402_HD,0402_CC; HEIGHT: 0.4 MM; TOL: 5%; Tolerance: 5%; ROHS: Yes; PCB Footprint: 0402_CC
R313 = RES_Dup1: RES MF 33K  1/16W 1% 0402; CLASS: DISCRETE; FPLIST: RC0402_25,RC0402_HD,0402_CC; CAD_APPROVED: Yes; Temp_Range: -55¡ãC ~ 155¡ãC; MFG_PN01: RC0402FR-0733KL; MFG_NAME01: YAGEO AMERICA; AGILE_PN: 470-31004; HEIGHT: 0.40 MM; ROHS: Yes; Tolerance: 1%; PCB Footprint: RC0402_25
U13 = AT25SF128A: IC MEM NOR FLASH DUAL/QUAD SPI 128MBIT 133MHZ 2.7-3.6V SOP8; AGILE_PN: 342-00805; MFG_NAME01: Adesto Technologies Corporation, Inc; Temp_Range: -40¡ãC ~ 85¡ãC; CAD_APPROVED: Yes; CLASS: IC; MFG_PN01: AT25SF128A-SHB-T; ROHS: Yes; HEIGHT: 2.16MM; PCB Footprint: SO8-25X75-200

## Sheet 10 ARDUINO_JTAG.SchDoc
size 513 x 386 mm
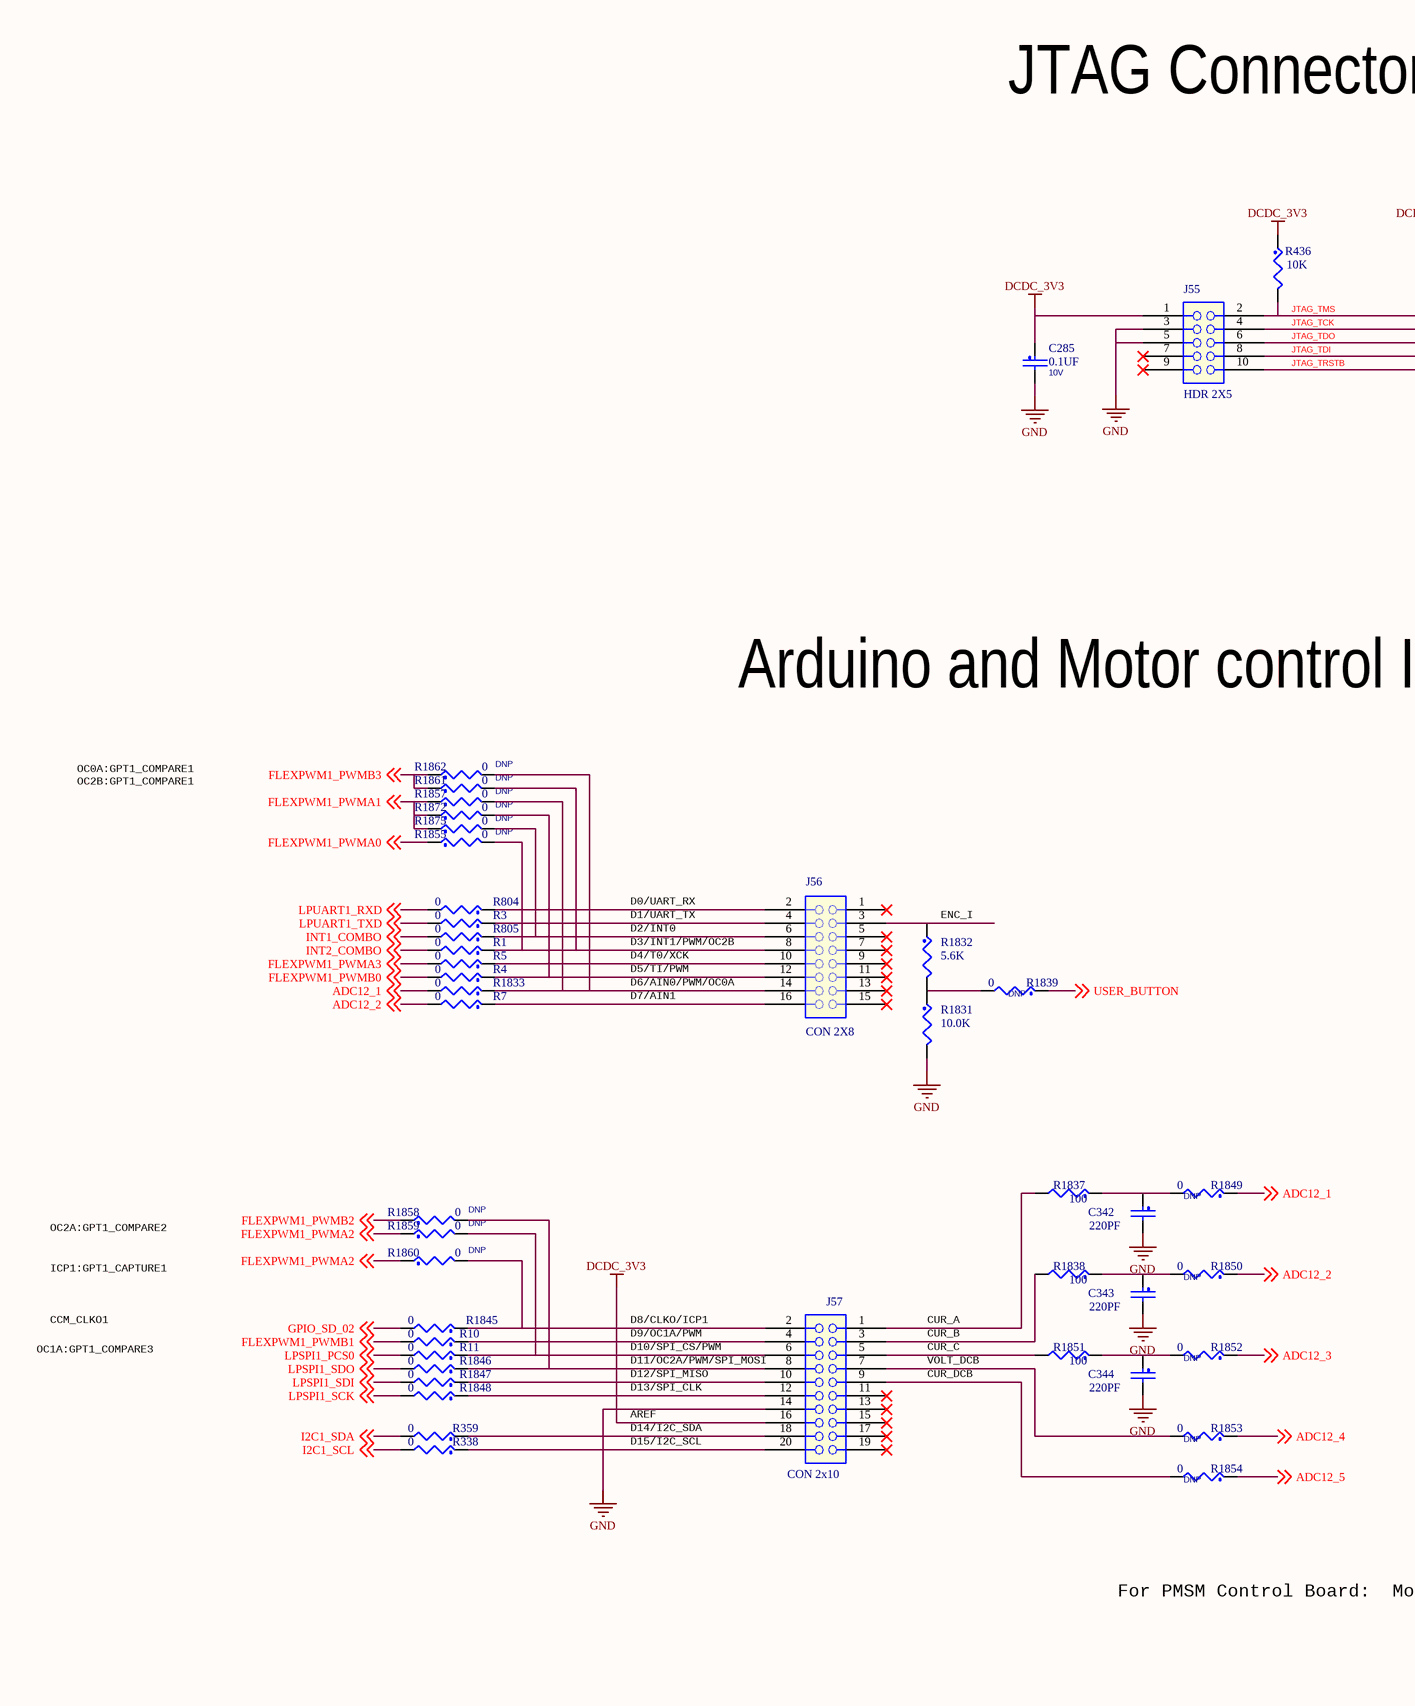
[diagram p10: 10 ARDUINO_JTAG.SchDoc, left]
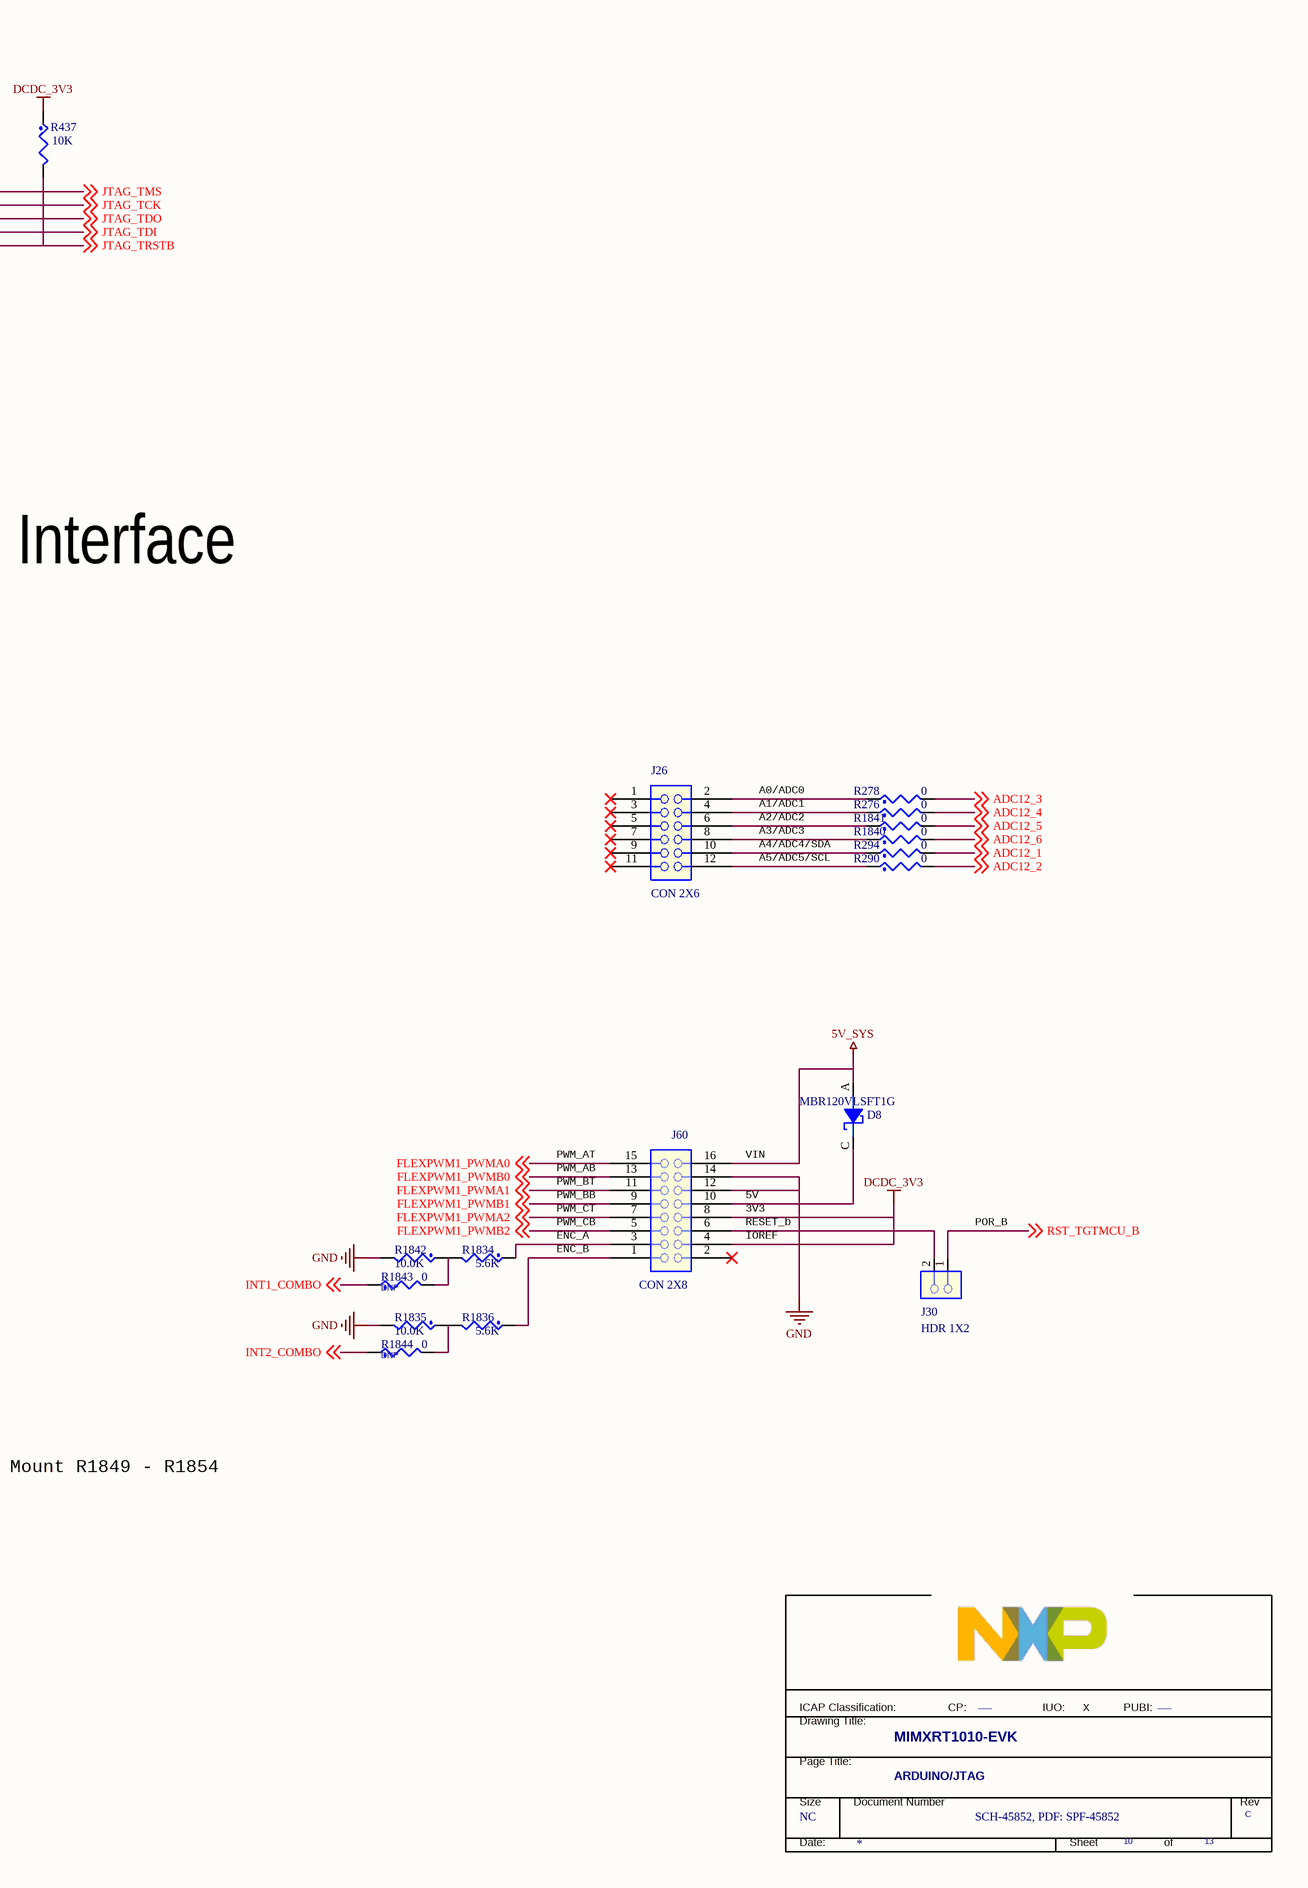
[diagram p11: 10 ARDUINO_JTAG.SchDoc, right]

### Parts
(Parts that share a designator on the sheet are numbered #1, #2 ... from top to bottom, then left to right.)
*#10  PUBI: ___  Doc: SCH-45852, PDF: SPF-45852  RevCode: C  Title: MIMXRT1010-EVK  Page Size: NC  Page Number: 10  Page Count: 13  PageTitle: ARDUINO/JTAG  (hidden comment: TitleBlock_FS)  (graphical)
C285  0.1UF  VOLTAGE: 10V  [CC0402_25]
C342  220PF  [CC0402_25]
C343  220PF  [CC0402_25]
C344  220PF  [CC0402_25]
D8  MBR120VLSFT1G  [SOD-123]
J26  CON 2X6  [con_skt2x6_th]
J30  HDR 1X2  [HDR102]
J55  HDR 2X5  [hdr205_50_th]
J56  CON 2X8  [con_2x8_skt_100_th]
J57  CON 2x10  [con_skt2x10_th]
J60  CON 2X8  [con_2x8_skt_100_th]
R1  0  [0402_CC]
R3  0  [0402_CC]
R4  0  [0402_CC]
R5  0  [0402_CC]
R7  0  [0402_CC]
R10  0  [0402_CC]
R11  0  [0402_CC]
R276  0  [0402_CC]
R278  0  [0402_CC]
R290  0  [0402_CC]
R294  0  [0402_CC]
R338  0  [0402_CC]
R359  0  [0402_CC]
R436  10K  [0402_CC]
R437  10K  [0402_CC]
R804  0  [0402_CC]
R805  0  [0402_CC]
R1831  10.0K  [RC0402_25]
R1832  5.6K  [RC0402_25]
R1833  0  [0402_CC]
R1834  5.6K  [RC0402_25]
R1835  10.0K  [RC0402_25]
R1836  5.6K  [RC0402_25]
R1837  100  [RC0402_25]
R1838  100  [RC0402_25]
R1839  0  ASSY_OPT: DNP  [0402_CC]
R1840  0  [0402_CC]
R1841  0  [0402_CC]
R1842  10.0K  [RC0402_25]
R1843  0  ASSY_OPT: DNP  [0402_CC]
R1844  0  ASSY_OPT: DNP  [0402_CC]
R1845  0  [0402_CC]
R1846  0  [0402_CC]
R1847  0  [0402_CC]
R1848  0  [0402_CC]
R1849  0  ASSY_OPT: DNP  [0402_CC]
R1850  0  ASSY_OPT: DNP  [0402_CC]
R1851  100  [RC0402_25]
R1852  0  ASSY_OPT: DNP  [0402_CC]
R1853  0  ASSY_OPT: DNP  [0402_CC]
R1854  0  ASSY_OPT: DNP  [0402_CC]
R1855  0  ASSY_OPT: DNP  [0402_CC]
R1857  0  ASSY_OPT: DNP  [0402_CC]
R1858  0  ASSY_OPT: DNP  [0402_CC]
R1859  0  ASSY_OPT: DNP  [0402_CC]
R1860  0  ASSY_OPT: DNP  [0402_CC]
R1861  0  ASSY_OPT: DNP  [0402_CC]
R1862  0  ASSY_OPT: DNP  [0402_CC]
R1872  0  ASSY_OPT: DNP  [0402_CC]
R1875  0  ASSY_OPT: DNP  [0402_CC]

### Nets
5V_SYS: D8.A J60.16(B8)
DCDC_3V3: C285.1 J55.1(A1) J57.16 J60.4(B2) J60.8(B4) R436.1 R437.1
GND: C285.2 C342.2 C343.2 C344.2 J55.3(A2) J55.5(A3) J57.14 J60.12(B6) J60.14(B7) R1831.2 R1835.2 R1842.2
ADC12_1: R294.2 R1833.2 R1849.1 ; off-sheet ADC12_1
ADC12_2: R7.2 R290.2 R1850.1 ; off-sheet ADC12_2
ADC12_3: R278.2 R1852.1 ; off-sheet ADC12_3
ADC12_6: R1840.2 ; off-sheet ADC12_6
FLEXPWM1_PWMA0: J60.15(A8) R1855.1 ; off-sheet FLEXPWM1_PWMA0
FLEXPWM1_PWMA1: J60.11(A6) R1857.1 R1872.1 R1875.1 ; off-sheet FLEXPWM1_PWMA1
FLEXPWM1_PWMA2: J60.7(A4) R1859.1 R1860.1 ; off-sheet FLEXPWM1_PWMA2
FLEXPWM1_PWMA3: R5.2 ; off-sheet FLEXPWM1_PWMA3
FLEXPWM1_PWMB0: J60.13(A7) R4.2 ; off-sheet FLEXPWM1_PWMB0
FLEXPWM1_PWMB1: J60.9(A5) R10.2 ; off-sheet FLEXPWM1_PWMB1
FLEXPWM1_PWMB2: J60.5(A3) R1858.1 ; off-sheet FLEXPWM1_PWMB2
FLEXPWM1_PWMB3: R1861.1 R1862.1 ; off-sheet FLEXPWM1_PWMB3
GPIO_SD_02: R1845.2 ; off-sheet GPIO_SD_02  [project net BT_CFG[0]]
I2C1_SCL: R338.2 ; off-sheet I2C1_SCL
I2C1_SDA: R359.2 ; off-sheet I2C1_SDA
INT1_COMBO: R11.2 R805.2 R1843.1 ; off-sheet INT1_COMBO, off-sheet LPSPI1_PCS0  [also labelled LPSPI1_PCS0]
INT2_COMBO: R1.2 R1844.1 R1848.2 ; off-sheet INT2_COMBO, off-sheet LPSPI1_SCK  [also labelled LPSPI1_SCK]
JTAG_TCK: J55.4(B2) ; off-sheet JTAG_TCK
JTAG_TDI: J55.8(B4) R1841.2 R1854.1 ; off-sheet JTAG_TDI, off-sheet ADC12_5  [also labelled ADC12_5]
JTAG_TDO: J55.6(B3) R276.2 R1853.1 ; off-sheet JTAG_TDO, off-sheet ADC12_4  [also labelled ADC12_4]
JTAG_TMS: J55.2(B1) R436.2 ; off-sheet JTAG_TMS
JTAG_TRSTB: J55.10(B5) R437.2 ; off-sheet JTAG_TRSTB
LPSPI1_SDI: R1847.2 ; off-sheet LPSPI1_SDI
LPSPI1_SDO: R1846.2 ; off-sheet LPSPI1_SDO
LPUART1_RXD: R804.2 ; off-sheet LPUART1_RXD
LPUART1_TXD: R3.2 ; off-sheet LPUART1_TXD
RST_TGTMCU_B: J30.1 ; off-sheet RST_TGTMCU_B  [project net POR_B]
USER_BUTTON: R1839.1 ; off-sheet USER_BUTTON
NetC342_1: C342.1 R1837.1 R1849.2
NetC343_1: C343.1 R1838.1 R1850.2
NetC344_1: C344.1 R1851.1 R1852.2
NetD8_C: D8.C J60.10(B5)
NetJ26_2: J26.2(B1) R278.1
NetJ26_4: J26.4(B2) R276.1
NetJ26_6: J26.6(B3) R1841.1
NetJ26_8: J26.8(B4) R1840.1
NetJ26_10: J26.10(B5) R294.1
NetJ26_12: J26.12(B6) R290.1
NetJ30_2: J30.2 J60.6(B3)
NetJ56_2: J56.2(B1) R804.1
NetJ56_3: J56.3(A2) R1832.1
NetJ56_4: J56.4(B2) R3.1
NetJ56_6: J56.6(B3) R805.1 R1875.2
NetJ56_8: J56.8(B4) R1.1 R1855.2 R1861.2
NetJ56_10: J56.10(B5) R5.1
NetJ56_12: J56.12(B6) R4.1 R1872.2
NetJ56_14: J56.14(B7) R1833.1 R1857.2 R1862.2
NetJ56_16: J56.16(B8) R7.1
NetJ57_1: J57.1 R1837.2
NetJ57_2: J57.2 R1845.1 R1860.2
NetJ57_3: J57.3 R1838.2
NetJ57_4: J57.4 R10.1
NetJ57_5: J57.5 R1851.2
NetJ57_6: J57.6 R11.1 R1859.2
NetJ57_7: J57.7 R1853.2
NetJ57_8: J57.8 R1846.1 R1858.2
NetJ57_9: J57.9 R1854.2
NetJ57_10: J57.10 R1847.1
NetJ57_12: J57.12 R1848.1
NetJ57_18: J57.18 R359.1
NetJ57_20: J57.20 R338.1
NetJ60_1: J60.1(A1) R1836.1
NetJ60_3: J60.3(A2) R1834.1
NetR1831_1: R1831.1 R1832.2 R1839.2
NetR1834_2: R1834.2 R1842.1 R1843.2
NetR1835_1: R1835.1 R1836.2 R1844.2

Not connected (* = marked no-connect by the designer): J26 1(A1)* 3(A2)* 5(A3)* 7(A4)* 9(A5)* 11(A6)*; J55 7(A4)* 9(A5)*; J56 1(A1)* 5(A3)* 7(A4)* 9(A5)* 11(A6)* 13(A7)* 15(A8)*; J57 11* 13* 15* 17* 19*; J60 2(B1)*

### Notes on the sheet
- JTAG Connector
- Arduino and Motor control Interface
- OC0A:GPT1_COMPARE1
  OC2B:GPT1_COMPARE1
- D1/UART_TX
- D2/INT0
- D0/UART_RX
- (near R1832) ENC_I
- A0/ADC0
- A1/ADC1
- D7/AIN1
- D4/T0/XCK
- D5/TI/PWM
- D6/AIN0/PWM/OC0A
- D3/INT1/PWM/OC2B
- A3/ADC3
- A2/ADC2
- A4/ADC4/SDA
- A5/ADC5/SCL
- OC2A:GPT1_COMPARE2
- ICP1:GPT1_CAPTURE1
- OC1A:GPT1_COMPARE3
- CCM_CLKO1
- D8/CLKO/ICP1
- D9/OC1A/PWM
- CUR_B
- CUR_A
- PWM_AT
- PWM_AB
- PWM_CT
- PWM_BT
- PWM_BB
- 3V3
- 5V
- VIN
- D10/SPI_CS/PWM
- D12/SPI_MISO
- D11/OC2A/PWM/SPI_MOSI
- D13/SPI_CLK
- CUR_C
- CUR_DCB
- VOLT_DCB
- ENC_A
- ENC_B
- PWM_CB
- RESET_b
- IOREF
- (near J30) POR_B
- D15/I2C_SCL
- D14/I2C_SDA
- AREF
- For PMSM Control Board:  Mount R1849 - R1854
- X
- (in symbol TitleBlock_FS) ICAP Classification:; CP:; IUO:; PUBI:; Drawing Title:; Page Title:; Size; Document Number; Rev; Date:; Sheet; of

### Library data of the parts
*#10 = TitleBlock_FS: FIUO: _X_; OrgAddr2: Austin, TX 78735-8598; OrgAddr1: 6501 William Cannon Drive West; OrgName: Freescale Semiconductor; FCP: ___; Page Create Date: March  8, 1995; Page Modify Date: *
C285 = CAP_NP: as C143 on sheet 09 FLEXSPI FLASH; PCB Footprint: CC0402_25; HEIGHT: 0.64MM; ROHS: Yes; Tolerance: 10%
C342-C344 = CAP_NP: CAP CER 220PF 50V 10% X7R 0402; CLASS: DISCRETE; AGILE_PN: 150-75829; MFG_NAME01: KEMET; MFG_PN01: C0402C221K5RAC; CAD_APPROVED: Yes; FPLIST: CC0402_25,CC0402_HD,0402_CC; Tolerance: 10%; ROHS: Yes; HEIGHT: 0.55MM; VOLTAGE: 50V; PCB Footprint: CC0402_25
D8 = DIODE_SCHTKY_Dup1: DIODE SCH RECT 1A 20V SMT; CLASS: IC; AGILE_PN: 480-75997; MFG_NAME01: ON SEMICONDUCTOR; CAD_APPROVED: Yes; MFG_PN01: MBR120VLSFT1G; ROHS: Yes; HEIGHT: 1MM; PCB Footprint: SOD-123
J26 = CONN_HDR_6X2: CON 2X6 SKT SHRD TH 100MIL CTR 345H AU 126L; CLASS: IO; AGILE_PN: 210-81774; MFG_NAME01: ANYTRONIC CORPORATION LIMITED; MFG_PN01: 08010S31211-29RF; Temp_Range: -40 to +105C; CAD_APPROVED: Yes; PCB Footprint: con_skt2x6_th; ROHS: Yes; HEIGHT: 8.75MM
J30 = CONN_HDR_2X1: HDR 1X2 TH 100MIL SP 339H AU 98L; CLASS: IO; AGILE_PN: 210-81490; MFG_NAME01: ANYTRONIC CORPORATION LIMITED; MFG_PN01: 0901S0202011N9T-31RF; Temp_Range: -55¡ãC to +105¡ãC; CAD_APPROVED: Yes; ROHS: Yes; HEIGHT: 8.59MM; PCB Footprint: HDR102
J55 = CONN_HDR_5X2: HDR 2X5 TH 50MIL CTR 172H AU 91L; CLASS: IO; AGILE_PN: 210-81466; MFG_NAME01: ANYTRONIC CORPORATION LIMITED; MFG_PN01: 0922S0205011N9T-31RF; Temp_Range: -55DegC to +105DegC; CAD_APPROVED: Yes; PCB Footprint: hdr205_50_th; ROHS: Yes; HEIGHT: 4.38MM
J56 J60 = CONN_HDR_8X2: CON 2X8 SKT SHRD TH 100MIL CTR 345H AU 126L; CLASS: IO; AGILE_PN: 210-81775; MFG_NAME01: ANYTRONIC CORPORATION LIMITED; MFG_PN01: 08010S31611-29RF; Temp_Range: -40 to +105C; CAD_APPROVED: Yes; PCB Footprint: con_2x8_skt_100_th; ROHS: Yes; HEIGHT: 8.75MM
J57 = CONN_HDR_10X2: CON 2X10 SKT SHRD TH 100MIL CTR 345H AU 126L; CLASS: IO; CAD_APPROVED: Yes; Temp_Range: -40 to +105C; MFG_PN01: 08010S32011-29RF; MFG_NAME01: ANYTRONIC CORPORATION LIMITED; AGILE_PN: 210-81776; PCB Footprint: con_skt2x10_th; HEIGHT: 8.75MM; ROHS: Yes
R1 R4 R5 R7 R11 R294 R359 R1833 R1839 R1841 R1845 R1847 R1854 R1855 R1857-R1859 R1861 R1872 R1875 = RES_Dup1: as R142 on sheet 09 FLEXSPI FLASH; PCB Footprint: 0402_CC; ROHS: Yes; Tolerance: 5%; HEIGHT: 0.45 MM
R3 R10 R276 R278 R290 R338 R804 R805 R1840 R1843 R1844 R1846 R1848-R1850 R1852 R1853 R1860 R1862 = RES_Dup1: RES MF ZERO OHM 1/16W 5% 0402; CLASS: DISCRETE; AGILE_PN: 470-75394; MFG_NAME01: ROHM; MFG_PN01: MCR01MZPJ000; CAD_APPROVED: Yes; FPLIST: RC0402_25,RC0402_HD,RC0402_X2,0402_CC; PCB Footprint: 0402_CC; HEIGHT: 0.45 MM; Tolerance: 5%; ROHS: Yes
R436 R437 = RES_Dup1: as R143 on sheet 09 FLEXSPI FLASH; PCB Footprint: 0402_CC; HEIGHT: 0.4 MM; TOL: 5%; Tolerance: 5%; ROHS: Yes
R1831 R1835 = RES_Dup1: RES MF 10.0K 1/16W 1% 0402; CLASS: DISCRETE; FPLIST: RC0402_25,RC0402_HD,0402_CC; CAD_APPROVED: Yes; MFG_PN01: WR04X1002FTL; MFG_NAME01: WALSIN TECHNOLOGY CORP.; AGILE_PN: 470-80574; PCB Footprint: RC0402_25; HEIGHT: 0.4MM; ROHS: Yes; Tolerance: 1%
R1832 R1836 = RES_Dup1: RES MF 5.6K  1/16W 1% 0402; CLASS: DISCRETE; AGILE_PN: 470-30919; MFG_NAME01: YAGEO AMERICA; MFG_PN01: RC0402FR-075K6L; Temp_Range: -55¡ãC ~ 155¡ãC; CAD_APPROVED: Yes; FPLIST: RC0402_25,RC0402_HD,0402_CC; PCB Footprint: RC0402_25; Tolerance: 1%; ROHS: Yes; HEIGHT: 0.40 MM
R1834 = RES_Dup1: RES MF 5.6K  1/16W 1% 0402; CLASS: DISCRETE; FPLIST: RC0402_25,RC0402_HD,0402_CC; CAD_APPROVED: Yes; Temp_Range: -55¡ãC ~ 155¡ãC; MFG_PN01: RC0402FR-075K6L; MFG_NAME01: YAGEO AMERICA; AGILE_PN: 470-30919; HEIGHT: 0.40 MM; ROHS: Yes; Tolerance: 1%; PCB Footprint: RC0402_25
R1837 R1838 R1851 = RES_Dup1: RES MF 100 OHM 1/16W 5% 0402; CLASS: DISCRETE; FPLIST: RC0402_25,RC0402_HD,RC0402_X2,0402_CC; CAD_APPROVED: Yes; MFG_PN01: NRCL04J101TRF; MFG_NAME01: NIC COMPONENTS CORP; AGILE_PN: 470-75591; HEIGHT: 0.45mm; ROHS: Yes; Tolerance: 5%; PCB Footprint: RC0402_25
R1842 = RES_Dup1: RES MF 10.0K 1/16W 1% 0402; CLASS: DISCRETE; AGILE_PN: 470-80574; MFG_NAME01: WALSIN TECHNOLOGY CORP.; MFG_PN01: WR04X1002FTL; CAD_APPROVED: Yes; FPLIST: RC0402_25,RC0402_HD,0402_CC; Tolerance: 1%; ROHS: Yes; HEIGHT: 0.4MM; PCB Footprint: RC0402_25